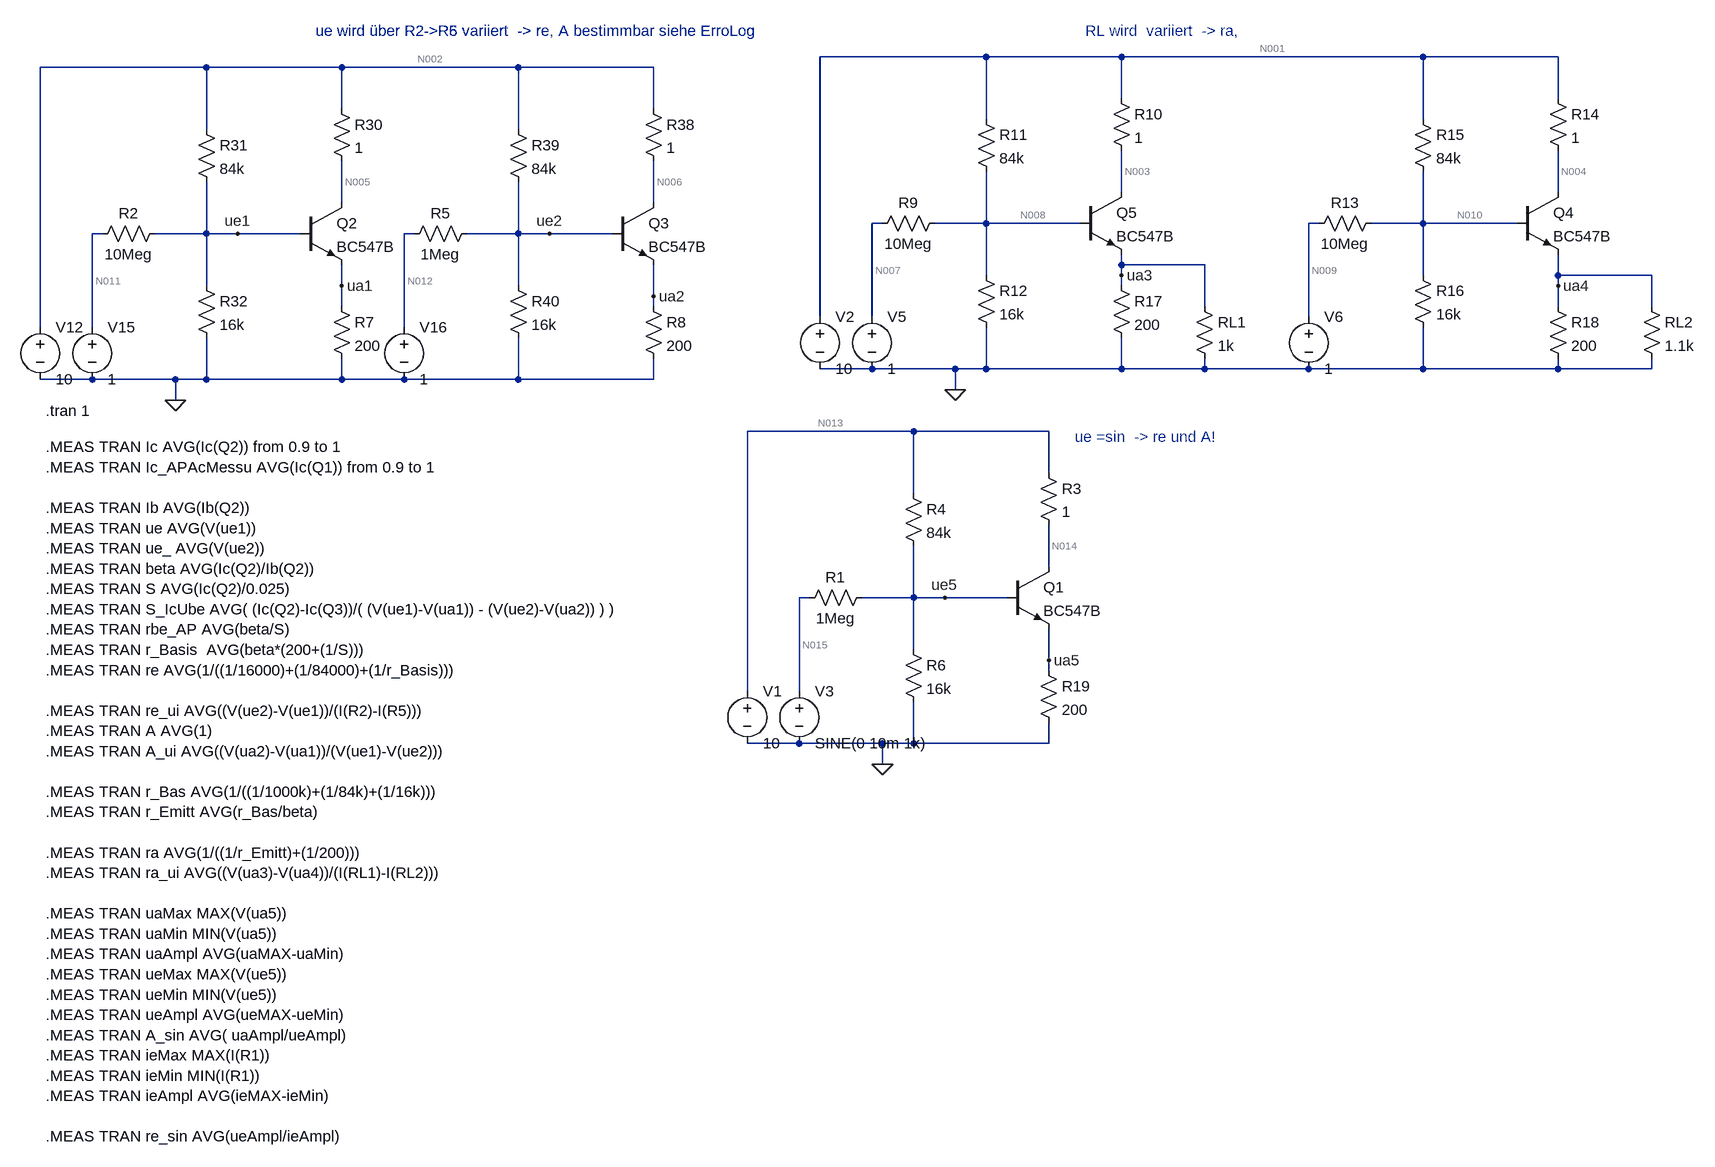
[diagram p0: schematic Tr_ColSchMitRe.asc]
Tr_ColSchMitRe.asc, the LTspice schematic file:
Version 4
SHEET 1 880 680
WIRE -3328 -1520 -3584 -1520
WIRE -3120 -1520 -3328 -1520
WIRE -2656 -1520 -3120 -1520
WIRE -2448 -1520 -2656 -1520
WIRE -4528 -1504 -4784 -1504
WIRE -4320 -1504 -4528 -1504
WIRE -4048 -1504 -4320 -1504
WIRE -3840 -1504 -4048 -1504
WIRE -3120 -1456 -3120 -1520
WIRE -2448 -1456 -2448 -1520
WIRE -4320 -1440 -4320 -1504
WIRE -3840 -1440 -3840 -1504
WIRE -3328 -1424 -3328 -1520
WIRE -2656 -1424 -2656 -1520
WIRE -4528 -1408 -4528 -1504
WIRE -4048 -1408 -4048 -1504
WIRE -3120 -1312 -3120 -1376
WIRE -2448 -1312 -2448 -1376
WIRE -4320 -1296 -4320 -1360
WIRE -3840 -1296 -3840 -1360
WIRE -3488 -1264 -3504 -1264
WIRE -3328 -1264 -3328 -1344
WIRE -3328 -1264 -3408 -1264
WIRE -3184 -1264 -3328 -1264
WIRE -2816 -1264 -2832 -1264
WIRE -2656 -1264 -2656 -1344
WIRE -2656 -1264 -2736 -1264
WIRE -2512 -1264 -2656 -1264
WIRE -4688 -1248 -4704 -1248
WIRE -4528 -1248 -4528 -1328
WIRE -4528 -1248 -4608 -1248
WIRE -4480 -1248 -4528 -1248
WIRE -4384 -1248 -4480 -1248
WIRE -4208 -1248 -4224 -1248
WIRE -4048 -1248 -4048 -1328
WIRE -4048 -1248 -4128 -1248
WIRE -4000 -1248 -4048 -1248
WIRE -3904 -1248 -4000 -1248
WIRE -3120 -1200 -3120 -1216
WIRE -2992 -1200 -3120 -1200
WIRE -3328 -1184 -3328 -1264
WIRE -3120 -1184 -3120 -1200
WIRE -2656 -1184 -2656 -1264
WIRE -2448 -1184 -2448 -1216
WIRE -2304 -1184 -2448 -1184
WIRE -4528 -1168 -4528 -1248
WIRE -4320 -1168 -4320 -1200
WIRE -4048 -1168 -4048 -1248
WIRE -3120 -1168 -3120 -1184
WIRE -2448 -1168 -2448 -1184
WIRE -3840 -1152 -3840 -1200
WIRE -4320 -1136 -4320 -1168
WIRE -3840 -1136 -3840 -1152
WIRE -2992 -1136 -2992 -1200
WIRE -2448 -1136 -2448 -1168
WIRE -2304 -1136 -2304 -1184
WIRE -3584 -1120 -3584 -1520
WIRE -3504 -1120 -3504 -1264
WIRE -2832 -1120 -2832 -1264
WIRE -4784 -1104 -4784 -1504
WIRE -4704 -1104 -4704 -1248
WIRE -4224 -1104 -4224 -1248
WIRE -3504 -1040 -3584 -1040
WIRE -3376 -1040 -3504 -1040
WIRE -3328 -1040 -3328 -1104
WIRE -3328 -1040 -3376 -1040
WIRE -3120 -1040 -3120 -1088
WIRE -3120 -1040 -3328 -1040
WIRE -2992 -1040 -2992 -1056
WIRE -2992 -1040 -3120 -1040
WIRE -2832 -1040 -2992 -1040
WIRE -2656 -1040 -2656 -1104
WIRE -2656 -1040 -2832 -1040
WIRE -2448 -1040 -2448 -1056
WIRE -2448 -1040 -2656 -1040
WIRE -2304 -1040 -2304 -1056
WIRE -2304 -1040 -2448 -1040
WIRE -4704 -1024 -4784 -1024
WIRE -4576 -1024 -4704 -1024
WIRE -4528 -1024 -4528 -1088
WIRE -4528 -1024 -4576 -1024
WIRE -4320 -1024 -4320 -1056
WIRE -4320 -1024 -4528 -1024
WIRE -4224 -1024 -4320 -1024
WIRE -4048 -1024 -4048 -1088
WIRE -4048 -1024 -4224 -1024
WIRE -3840 -1024 -3840 -1056
WIRE -3840 -1024 -4048 -1024
WIRE -3376 -1008 -3376 -1040
WIRE -4576 -992 -4576 -1024
WIRE -3440 -944 -3696 -944
WIRE -3232 -944 -3440 -944
WIRE -3232 -880 -3232 -944
WIRE -3440 -848 -3440 -944
WIRE -3232 -736 -3232 -800
WIRE -3600 -688 -3616 -688
WIRE -3440 -688 -3440 -768
WIRE -3440 -688 -3520 -688
WIRE -3392 -688 -3440 -688
WIRE -3296 -688 -3392 -688
WIRE -3440 -608 -3440 -688
WIRE -3232 -592 -3232 -640
WIRE -3232 -576 -3232 -592
WIRE -3696 -544 -3696 -944
WIRE -3616 -544 -3616 -688
WIRE -3616 -464 -3696 -464
WIRE -3488 -464 -3616 -464
WIRE -3440 -464 -3440 -528
WIRE -3440 -464 -3488 -464
WIRE -3232 -464 -3232 -496
WIRE -3232 -464 -3440 -464
WIRE -3488 -432 -3488 -464
FLAG -3376 -1008 0
FLAG -4576 -992 0
FLAG -4480 -1248 ue1
FLAG -4000 -1248 ue2
FLAG -3488 -432 0
FLAG -3392 -688 ue5
FLAG -4320 -1168 ua1
FLAG -3840 -1152 ua2
FLAG -3120 -1184 ua3
FLAG -2448 -1168 ua4
FLAG -3232 -592 ua5
SYMBOL voltage -3584 -1136 R0
WINDOW 123 0 0 Left 2
WINDOW 39 0 0 Left 2
SYMATTR InstName V2
SYMATTR Value 10
SYMBOL npn -3184 -1312 R0
SYMATTR InstName Q5
SYMATTR Value BC547B
SYMBOL res -3392 -1280 R90
WINDOW 0 0 56 VBottom 2
WINDOW 3 32 56 VTop 2
SYMATTR InstName R9
SYMATTR Value 10Meg
SYMBOL voltage -3504 -1136 R0
WINDOW 123 0 0 Left 2
WINDOW 39 0 0 Left 2
SYMATTR InstName V5
SYMATTR Value 1
SYMBOL res -3136 -1472 R0
SYMATTR InstName R10
SYMATTR Value 1
SYMBOL res -3344 -1440 R0
SYMATTR InstName R11
SYMATTR Value 84k
SYMBOL res -3344 -1200 R0
SYMATTR InstName R12
SYMATTR Value 16k
SYMBOL npn -2512 -1312 R0
SYMATTR InstName Q4
SYMATTR Value BC547B
SYMBOL res -2720 -1280 R90
WINDOW 0 0 56 VBottom 2
WINDOW 3 32 56 VTop 2
SYMATTR InstName R13
SYMATTR Value 10Meg
SYMBOL voltage -2832 -1136 R0
WINDOW 123 0 0 Left 2
WINDOW 39 0 0 Left 2
SYMATTR InstName V6
SYMATTR Value 1
SYMBOL res -2464 -1472 R0
SYMATTR InstName R14
SYMATTR Value 1
SYMBOL res -2672 -1440 R0
SYMATTR InstName R15
SYMATTR Value 84k
SYMBOL res -2672 -1200 R0
SYMATTR InstName R16
SYMATTR Value 16k
SYMBOL res -3008 -1152 R0
SYMATTR InstName RL1
SYMATTR Value 1k
SYMBOL res -2320 -1152 R0
SYMATTR InstName RL2
SYMATTR Value 1.1k
SYMBOL voltage -4784 -1120 R0
WINDOW 123 0 0 Left 2
WINDOW 39 0 0 Left 2
SYMATTR InstName V12
SYMATTR Value 10
SYMBOL npn -4384 -1296 R0
SYMATTR InstName Q2
SYMATTR Value BC547B
SYMBOL res -4592 -1264 R90
WINDOW 0 0 56 VBottom 2
WINDOW 3 32 56 VTop 2
SYMATTR InstName R2
SYMATTR Value 10Meg
SYMBOL voltage -4704 -1120 R0
WINDOW 123 0 0 Left 2
WINDOW 39 0 0 Left 2
SYMATTR InstName V15
SYMATTR Value 1
SYMBOL res -4336 -1456 R0
SYMATTR InstName R30
SYMATTR Value 1
SYMBOL res -4544 -1424 R0
SYMATTR InstName R31
SYMATTR Value 84k
SYMBOL res -4544 -1184 R0
SYMATTR InstName R32
SYMATTR Value 16k
SYMBOL npn -3904 -1296 R0
SYMATTR InstName Q3
SYMATTR Value BC547B
SYMBOL res -4112 -1264 R90
WINDOW 0 0 56 VBottom 2
WINDOW 3 32 56 VTop 2
SYMATTR InstName R5
SYMATTR Value 1Meg
SYMBOL voltage -4224 -1120 R0
WINDOW 123 0 0 Left 2
WINDOW 39 0 0 Left 2
SYMATTR InstName V16
SYMATTR Value 1
SYMBOL res -3856 -1456 R0
SYMATTR InstName R38
SYMATTR Value 1
SYMBOL res -4064 -1424 R0
SYMATTR InstName R39
SYMATTR Value 84k
SYMBOL res -4064 -1184 R0
SYMATTR InstName R40
SYMATTR Value 16k
SYMBOL voltage -3696 -560 R0
WINDOW 123 0 0 Left 2
WINDOW 39 0 0 Left 2
SYMATTR InstName V1
SYMATTR Value 10
SYMBOL npn -3296 -736 R0
SYMATTR InstName Q1
SYMATTR Value BC547B
SYMBOL res -3504 -704 R90
WINDOW 0 0 56 VBottom 2
WINDOW 3 32 56 VTop 2
SYMATTR InstName R1
SYMATTR Value 1Meg
SYMBOL voltage -3616 -560 R0
WINDOW 123 0 0 Left 2
WINDOW 39 0 0 Left 2
SYMATTR InstName V3
SYMATTR Value SINE(0 10m 1k)
SYMBOL res -3248 -896 R0
SYMATTR InstName R3
SYMATTR Value 1
SYMBOL res -3456 -864 R0
SYMATTR InstName R4
SYMATTR Value 84k
SYMBOL res -3456 -624 R0
SYMATTR InstName R6
SYMATTR Value 16k
SYMBOL res -4336 -1152 R0
SYMATTR InstName R7
SYMATTR Value 200
SYMBOL res -3856 -1152 R0
SYMATTR InstName R8
SYMATTR Value 200
SYMBOL res -3136 -1184 R0
SYMATTR InstName R17
SYMATTR Value 200
SYMBOL res -2464 -1152 R0
SYMATTR InstName R18
SYMATTR Value 200
SYMBOL res -3248 -592 R0
SYMATTR InstName R19
SYMATTR Value 200
TEXT -4776 -920 Left 2 !.MEAS TRAN Ic AVG(Ic(Q2)) from 0.9 to 1\n.MEAS TRAN Ic_APAcMessu AVG(Ic(Q1)) from 0.9 to 1\n \n.MEAS TRAN Ib AVG(Ib(Q2))\n.MEAS TRAN ue AVG(V(ue1))\n.MEAS TRAN ue_ AVG(V(ue2))\n.MEAS TRAN beta AVG(Ic(Q2)/Ib(Q2))\n.MEAS TRAN S AVG(Ic(Q2)/0.025)\n.MEAS TRAN S_IcUbe AVG( (Ic(Q2)-Ic(Q3))/( (V(ue1)-V(ua1)) - (V(ue2)-V(ua2)) ) )\n.MEAS TRAN rbe_AP AVG(beta/S)\n.MEAS TRAN r_Basis  AVG(beta*(200+(1/S)))\n.MEAS TRAN re AVG(1/((1/16000)+(1/84000)+(1/r_Basis)))\n \n.MEAS TRAN re_ui AVG((V(ue2)-V(ue1))/(I(R2)-I(R5)))\n.MEAS TRAN A AVG(1)\n.MEAS TRAN A_ui AVG((V(ua2)-V(ua1))/(V(ue1)-V(ue2)))\n \n.MEAS TRAN r_Bas AVG(1/((1/1000k)+(1/84k)+(1/16k)))\n.MEAS TRAN r_Emitt AVG(r_Bas/beta)\n \n.MEAS TRAN ra AVG(1/((1/r_Emitt)+(1/200)))\n.MEAS TRAN ra_ui AVG((V(ua3)-V(ua4))/(I(RL1)-I(RL2)))\n \n.MEAS TRAN uaMax MAX(V(ua5))\n.MEAS TRAN uaMin MIN(V(ua5))\n.MEAS TRAN uaAmpl AVG(uaMAX-uaMin)\n.MEAS TRAN ueMax MAX(V(ue5))\n.MEAS TRAN ueMin MIN(V(ue5))\n.MEAS TRAN ueAmpl AVG(ueMAX-ueMin)\n.MEAS TRAN A_sin AVG( uaAmpl/ueAmpl) \n.MEAS TRAN ieMax MAX(I(R1))\n.MEAS TRAN ieMin MIN(I(R1))\n.MEAS TRAN ieAmpl AVG(ieMAX-ieMin)\n \n.MEAS TRAN re_sin AVG(ueAmpl/ieAmpl)
TEXT -4776 -976 Left 2 !.tran 1
TEXT -4360 -1560 Left 2 ;ue wird über R2->R5 variiert  -> re, A bestimmbar siehe ErroLog
TEXT -3176 -1560 Left 2 ;RL wird  variiert  -> ra,
TEXT -4360 -1560 Left 2 ;ue wird über R2->R6 variiert  -> re, A bestimmbar siehe ErroLog
TEXT -3192 -936 Left 2 ;ue =sin  -> re und A!

The netlist it stands for:
* Tr_ColSchMitRe.asc
V2 N001 0 10
Q5 N003 N008 ua3 0 BC547B
R9 N008 N007 10Meg
V5 N007 0 1
R10 N001 N003 1
R11 N001 N008 84k
R12 N008 0 16k
Q4 N004 N010 ua4 0 BC547B
R13 N010 N009 10Meg
V6 N009 0 1
R14 N001 N004 1
R15 N001 N010 84k
R16 N010 0 16k
RL1 ua3 0 1k
RL2 ua4 0 1.1k
V12 N002 0 10
Q2 N005 ue1 ua1 0 BC547B
R2 ue1 N011 10Meg
V15 N011 0 1
R30 N002 N005 1
R31 N002 ue1 84k
R32 ue1 0 16k
Q3 N006 ue2 ua2 0 BC547B
R5 ue2 N012 1Meg
V16 N012 0 1
R38 N002 N006 1
R39 N002 ue2 84k
R40 ue2 0 16k
V1 N013 0 10
Q1 N014 ue5 ua5 0 BC547B
R1 ue5 N015 1Meg
V3 N015 0 SINE(0 10m 1k)
R3 N013 N014 1
R4 N013 ue5 84k
R6 ue5 0 16k
R7 ua1 0 200
R8 ua2 0 200
R17 ua3 0 200
R18 ua4 0 200
R19 ua5 0 200
.model NPN NPN
.model PNP PNP
.lib standard.bjt
.MEAS TRAN Ic AVG(Ic(Q2)) from 0.9 to 1
.MEAS TRAN Ic_APAcMessu AVG(Ic(Q1)) from 0.9 to 1
.MEAS TRAN Ib AVG(Ib(Q2))
.MEAS TRAN ue AVG(V(ue1))
.MEAS TRAN ue_ AVG(V(ue2))
.MEAS TRAN beta AVG(Ic(Q2)/Ib(Q2))
.MEAS TRAN S AVG(Ic(Q2)/0.025)
.MEAS TRAN S_IcUbe AVG( (Ic(Q2)-Ic(Q3))/( (V(ue1)-V(ua1)) - (V(ue2)-V(ua2)) ) )
.MEAS TRAN rbe_AP AVG(beta/S)
.MEAS TRAN r_Basis  AVG(beta*(200+(1/S)))
.MEAS TRAN re AVG(1/((1/16000)+(1/84000)+(1/r_Basis)))
.MEAS TRAN re_ui AVG((V(ue2)-V(ue1))/(I(R2)-I(R5)))
.MEAS TRAN A AVG(1)
.MEAS TRAN A_ui AVG((V(ua2)-V(ua1))/(V(ue1)-V(ue2)))
.MEAS TRAN r_Bas AVG(1/((1/1000k)+(1/84k)+(1/16k)))
.MEAS TRAN r_Emitt AVG(r_Bas/beta)
.MEAS TRAN ra AVG(1/((1/r_Emitt)+(1/200)))
.MEAS TRAN ra_ui AVG((V(ua3)-V(ua4))/(I(RL1)-I(RL2)))
.MEAS TRAN uaMax MAX(V(ua5))
.MEAS TRAN uaMin MIN(V(ua5))
.MEAS TRAN uaAmpl AVG(uaMAX-uaMin)
.MEAS TRAN ueMax MAX(V(ue5))
.MEAS TRAN ueMin MIN(V(ue5))
.MEAS TRAN ueAmpl AVG(ueMAX-ueMin)
.MEAS TRAN A_sin AVG( uaAmpl/ueAmpl)
.MEAS TRAN ieMax MAX(I(R1))
.MEAS TRAN ieMin MIN(I(R1))
.MEAS TRAN ieAmpl AVG(ieMAX-ieMin)
.MEAS TRAN re_sin AVG(ueAmpl/ieAmpl)
.tran 1
* ue wird über R2->R5 variiert  -> re, A bestimmbar siehe ErroLog
* RL wird  variiert  -> ra,
* ue wird über R2->R6 variiert  -> re, A bestimmbar siehe ErroLog
* ue =sin  -> re und A!
.backanno
.end

* Results of the author's LTspice run, read from the files saved beside the schematic
* Operating Point, zero values left out:
*   V(n001) = 10 V
*   V(n003) = 9.996 V
*   V(n008) = 1.412 V
*   V(ua3) = 735.6 mV
*   V(n007) = 1 V
*   V(n004) = 9.996 V
*   V(n010) = 1.414 V
*   V(ua4) = 738.2 mV
*   V(n009) = 1 V
*   V(n002) = 10 V
*   V(n005) = 9.996 V
*   V(ue1) = 1.437 V
*   V(ua1) = 765.2 mV
*   V(n011) = 1 V
*   V(n006) = 9.996 V
*   V(ue2) = 1.433 V
*   V(ua2) = 761 mV
*   V(n012) = 1 V
*   V(n013) = 10 V
*   V(n014) = 9.996 V
*   V(ue5) = 1.422 V
*   V(ua5) = 750.5 mV
*   Ic(Q1) = 3.74 mA
*   Ib(Q1) = 11.81 µA
*   Ie(Q1) = -3.752 mA
*   Ic(Q3) = 3.793 mA
*   Ib(Q3) = 11.98 µA
*   Ie(Q3) = -3.805 mA
*   Ic(Q2) = 3.814 mA
*   Ib(Q2) = 12.05 µA
*   Ie(Q2) = -3.826 mA
*   Ic(Q4) = 4.348 mA
*   Ib(Q4) = 13.78 µA
*   Ie(Q4) = -4.362 mA
*   Ic(Q5) = 4.4 mA
*   Ib(Q5) = 13.94 µA
*   Ie(Q5) = -4.414 mA
*   I(R19) = 3.752 mA
*   I(R18) = 3.691 mA
*   I(R17) = 3.678 mA
*   I(R8) = 3.805 mA
*   I(R7) = 3.826 mA
*   I(R6) = 88.89 µA
*   I(R4) = 102.1 µA
*   I(R3) = 3.74 mA
*   I(R1) = 1.422 µA
*   I(R40) = 89.57 µA
*   I(R39) = 102 µA
*   I(R38) = 3.793 mA
*   I(R5) = 433.2 nA
*   I(R32) = 89.84 µA
*   I(R31) = 101.9 µA
*   I(R30) = 3.814 mA
*   I(R2) = 43.75 nA
*   I(Rl2) = 671.1 µA
*   I(Rl1) = 735.6 µA
*   I(R16) = 88.39 µA
*   I(R15) = 102.2 µA
*   I(R14) = 4.348 mA
*   I(R13) = 41.43 nA
*   I(R12) = 88.25 µA
*   I(R11) = 102.2 µA
*   I(R10) = 4.4 mA
*   I(R9) = 41.2 nA
*   I(V3) = 1.422 µA
*   I(V1) = -3.843 mA
*   I(V16) = 433.2 nA
*   I(V15) = 43.75 nA
*   I(V12) = -7.811 mA
*   I(V6) = 41.43 nA
*   I(V5) = 41.2 nA
*   I(V2) = -8.953 mA
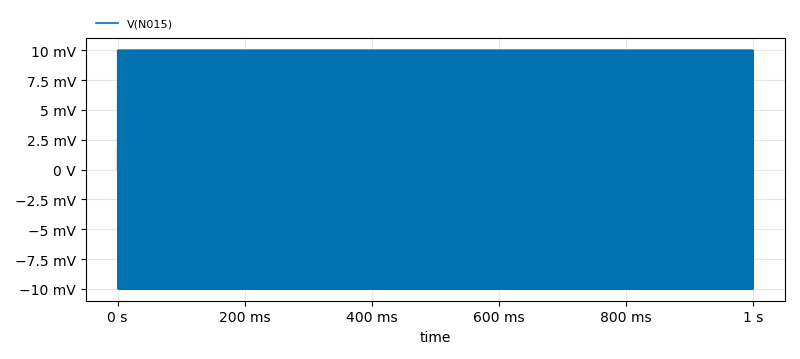
[diagram p1: Transient Analysis of Tr_ColSchMitRe.asc, plotted from the saved traces]
* Transient Analysis, 1 run:
*   V(N015): min -9.995 mV, max 9.995 mV, average 2.918 nV, rms 7.188 mV, last 0 V
* From the log:
*   ic: AVG(ic(q2))=0.00381392 FROM 0.9 TO 1
*   ic_apacmessu: AVG(ic(q1))=0.00374047 FROM 0.9 TO 1
*   ib: AVG(ib(q2))=1.2048e-005 FROM 0 TO 1
*   ue: AVG(v(ue1))=1.43749 FROM 0 TO 1
*   ue_: AVG(v(ue2))=1.43316 FROM 0 TO 1
*   beta: AVG(ic(q2)/ib(q2))=316.56 FROM 0 TO 1
*   s: AVG(ic(q2)/0.025)=0.152557 FROM 0 TO 1
*   s_icube: AVG( (ic(q2)-ic(q3))/( (v(ue1)-v(ua1)) - (v(ue2)-v(ua2)) ) )=0.131952 FROM 0 TO 1
*   rbe_ap: AVG(beta/s)=2075.03 FROM 0 TO 1
*   r_basis: AVG(beta*(200+(1/s)))=65387 FROM 0 TO 1
*   re: AVG(1/((1/16000)+(1/84000)+(1/r_basis)))=11148.5 FROM 0 TO 1
*   re_ui: AVG((v(ue2)-v(ue1))/(i(r2)-i(r5)))=11097.7 FROM 0 TO 1
*   a: AVG(1)=1 FROM 0 TO 1
*   a_ui: AVG((v(ua2)-v(ua1))/(v(ue1)-v(ue2)))=-0.963606 FROM 0 TO 1
*   r_bas: AVG(1/((1/1000k)+(1/84k)+(1/16k)))=13261.8 FROM 0 TO 1
*   r_emitt: AVG(r_bas/beta)=41.8934 FROM 0 TO 1
*   ra: AVG(1/((1/r_emitt)+(1/200)))=34.6379 FROM 0 TO 1
*   ra_ui: AVG((v(ua3)-v(ua4))/(i(rl1)-i(rl2)))=-40.0026 FROM 0 TO 1
*   uamax: MAX(v(ua5))=0.750561 FROM 0 TO 1
*   uamin: MIN(v(ua5))=0.75035 FROM 0 TO 1
*   uaampl: AVG(uamax-uamin)=0.000210822 FROM 0 TO 1
*   uemax: MAX(v(ue5))=1.4223 FROM 0 TO 1
*   uemin: MIN(v(ue5))=1.42208 FROM 0 TO 1
*   ueampl: AVG(uemax-uemin)=0.000218987 FROM 0 TO 1
*   a_sin: AVG( uaampl/ueampl)=0.962711 FROM 0 TO 1
*   iemax: MAX(i(r1))=1.43205e-006 FROM 0 TO 1
*   iemin: MIN(i(r1))=1.41233e-006 FROM 0 TO 1
*   ieampl: AVG(iemax-iemin)=1.97174e-008 FROM 0 TO 1
*   re_sin: AVG(ueampl/ieampl)=11106.3 FROM 0 TO 1